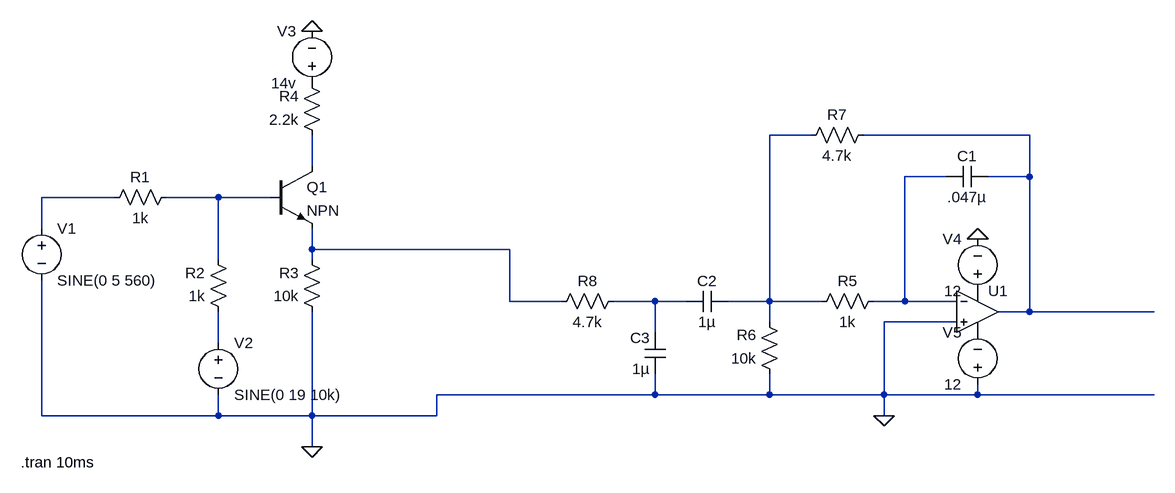
[diagram p0: schematic 18311a1930 PAM Gen And Det.asc]
18311a1930 PAM Gen And Det.asc, the LTspice schematic file:
Version 4
SHEET 1 1700 680
WIRE 1168 -80 1104 -80
WIRE 1504 -80 1248 -80
WIRE 400 -32 400 -80
WIRE 1376 -16 1312 -16
WIRE 1504 -16 1504 -80
WIRE 1504 -16 1440 -16
WIRE 96 16 -16 16
WIRE 256 16 176 16
WIRE 336 16 256 16
WIRE -16 64 -16 16
WIRE 400 96 400 64
WIRE 704 96 400 96
WIRE 256 112 256 16
WIRE 400 112 400 96
WIRE 704 176 704 96
WIRE 784 176 704 176
WIRE 928 176 864 176
WIRE 976 176 928 176
WIRE 1104 176 1104 -80
WIRE 1104 176 1040 176
WIRE 1184 176 1104 176
WIRE 1312 176 1312 -16
WIRE 1312 176 1264 176
WIRE 1392 176 1312 176
WIRE 1504 192 1504 -16
WIRE 1504 192 1456 192
WIRE 1696 192 1504 192
WIRE 1104 208 1104 176
WIRE 1392 208 1280 208
WIRE 928 224 928 176
WIRE 256 240 256 192
WIRE 928 320 928 288
WIRE 928 320 592 320
WIRE 1104 320 1104 288
WIRE 1104 320 928 320
WIRE 1280 320 1280 208
WIRE 1280 320 1104 320
WIRE 1424 320 1424 304
WIRE 1424 320 1280 320
WIRE 1696 320 1424 320
WIRE -16 352 -16 144
WIRE 256 352 256 320
WIRE 256 352 -16 352
WIRE 400 352 400 192
WIRE 400 352 256 352
WIRE 592 352 592 320
WIRE 592 352 400 352
WIRE 1280 352 1280 320
WIRE 400 400 400 352
FLAG 400 -240 0
FLAG 400 400 0
FLAG 1424 80 0
FLAG 1280 352 0
SYMBOL res 272 208 R180
WINDOW 0 36 76 Left 2
WINDOW 3 36 40 Left 2
SYMATTR InstName R2
SYMATTR Value 1k
SYMBOL res 416 208 R180
WINDOW 0 36 76 Left 2
WINDOW 3 36 40 Left 2
SYMATTR InstName R3
SYMATTR Value 10k
SYMBOL res 416 -64 R180
WINDOW 0 36 76 Left 2
WINDOW 3 36 40 Left 2
SYMATTR InstName R4
SYMATTR Value 2.2k
SYMBOL npn 336 -32 R0
SYMATTR InstName Q1
SYMBOL res 192 0 R90
WINDOW 0 0 56 VBottom 2
WINDOW 3 32 56 VTop 2
SYMATTR InstName R1
SYMATTR Value 1k
SYMBOL voltage -16 48 R0
WINDOW 123 0 0 Left 0
WINDOW 39 0 0 Left 0
SYMATTR InstName V1
SYMATTR Value SINE(0 5 560)
SYMBOL voltage 256 224 R0
WINDOW 123 0 0 Left 0
WINDOW 39 0 0 Left 0
SYMATTR InstName V2
SYMATTR Value SINE(0 19 10k)
SYMBOL voltage 400 -144 R180
WINDOW 0 24 96 Left 2
WINDOW 3 24 16 Left 2
WINDOW 123 0 0 Left 0
WINDOW 39 0 0 Left 0
SYMATTR InstName V3
SYMATTR Value 14v
SYMBOL voltage 1424 176 R180
WINDOW 0 24 96 Left 2
WINDOW 3 24 16 Left 2
WINDOW 123 0 0 Left 0
WINDOW 39 0 0 Left 0
SYMATTR InstName V4
SYMATTR Value 12
SYMBOL voltage 1424 320 R180
WINDOW 0 24 96 Left 2
WINDOW 3 24 16 Left 2
WINDOW 123 0 0 Left 0
WINDOW 39 0 0 Left 0
SYMATTR InstName V5
SYMATTR Value 12
SYMBOL res 1280 160 R90
WINDOW 0 0 56 VBottom 2
WINDOW 3 32 56 VTop 2
SYMATTR InstName R5
SYMATTR Value 1k
SYMBOL res 1120 304 R180
WINDOW 0 36 76 Left 2
WINDOW 3 36 40 Left 2
SYMATTR InstName R6
SYMATTR Value 10k
SYMBOL cap 1440 -32 R90
WINDOW 0 0 32 VBottom 2
WINDOW 3 32 32 VTop 2
SYMATTR InstName C1
SYMATTR Value .047µ
SYMBOL cap 1040 160 R90
WINDOW 0 0 32 VBottom 2
WINDOW 3 32 32 VTop 2
SYMATTR InstName C2
SYMATTR Value 1µ
SYMATTR SpiceLine V=6.3 Irms=0 Rser=0 Lser=0 mfg="Murata" pn="GRM153R60J105ME15" type="X5R"
SYMBOL cap 944 288 R180
WINDOW 0 24 56 Left 2
WINDOW 3 24 8 Left 2
SYMATTR InstName C3
SYMATTR Value 1µ
SYMBOL Opamps\\UniversalOpamp2 1424 192 R0
SYMATTR InstName U1
SYMBOL res 1264 -96 R90
WINDOW 0 0 56 VBottom 2
WINDOW 3 32 56 VTop 2
SYMATTR InstName R7
SYMATTR Value 4.7k
SYMBOL res 880 160 R90
WINDOW 0 0 56 VBottom 2
WINDOW 3 32 56 VTop 2
SYMATTR InstName R8
SYMATTR Value 4.7k
TEXT -48 424 Left 2 !.tran 10ms

The netlist it stands for:
* 18311a1930 PAM Gen And Det.asc
R2 N009 N006 1k
R3 0 N007 10k
R4 N003 P001 2.2k
Q1 N003 N006 N007 0 NPN
R1 N006 N005 1k
V1 N005 0 SINE(0 5 560)
V2 N009 0 SINE(0 19 10k)
V3 P001 0 14v
V4 P002 0 12
V5 0 P003 12
R5 N004 N001 1k
R6 0 N001 10k
C1 N002 N004 .047µ
C2 N001 N008 1µ V=6.3 Irms=0 Rser=0 Lser=0 mfg="Murata" pn="GRM153R60J105ME15" type="X5R"
C3 0 N008 1µ
XU1 0 N004 P002 P003 N002 level.2 Avol=1Meg GBW=10Meg Slew=10Meg ilimit=25m rail=0 Vos=0 phimargin=45 en=0 enk=0 in=0 ink=0 Rin=500Meg  ; pins IN+ IN- V+ V- OUT
R7 N002 N001 4.7k
R8 N008 N007 4.7k
.model NPN NPN
.model PNP PNP
.lib standard.bjt
.tran 10ms
.lib UniversalOpamps2.sub
.backanno
.end